# EAGLE design texboard (EAGLE 9.1.2)
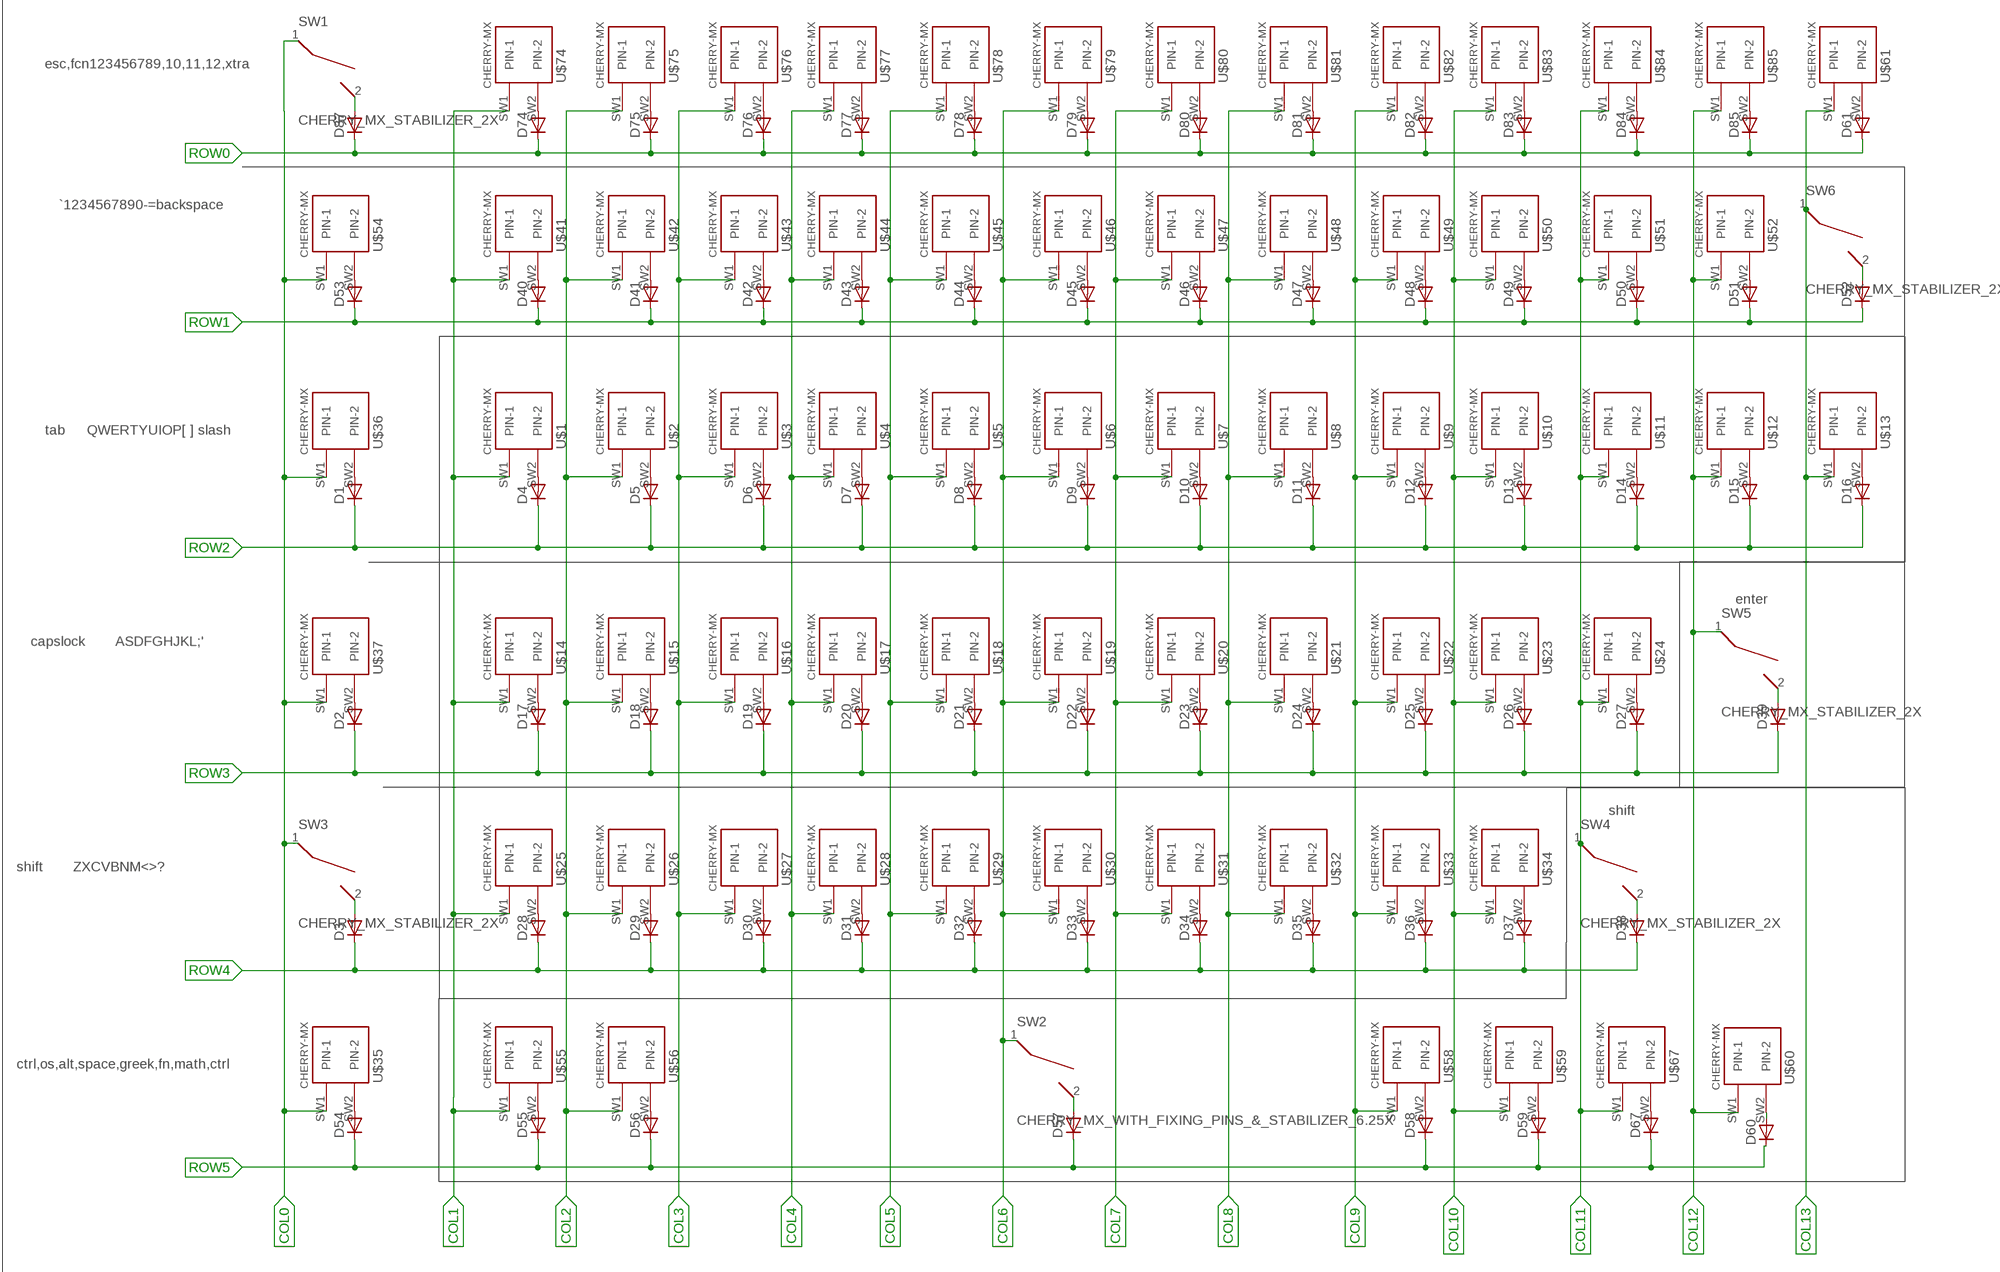
[diagram p0: schematic, sheet 1, part 1 of 2]
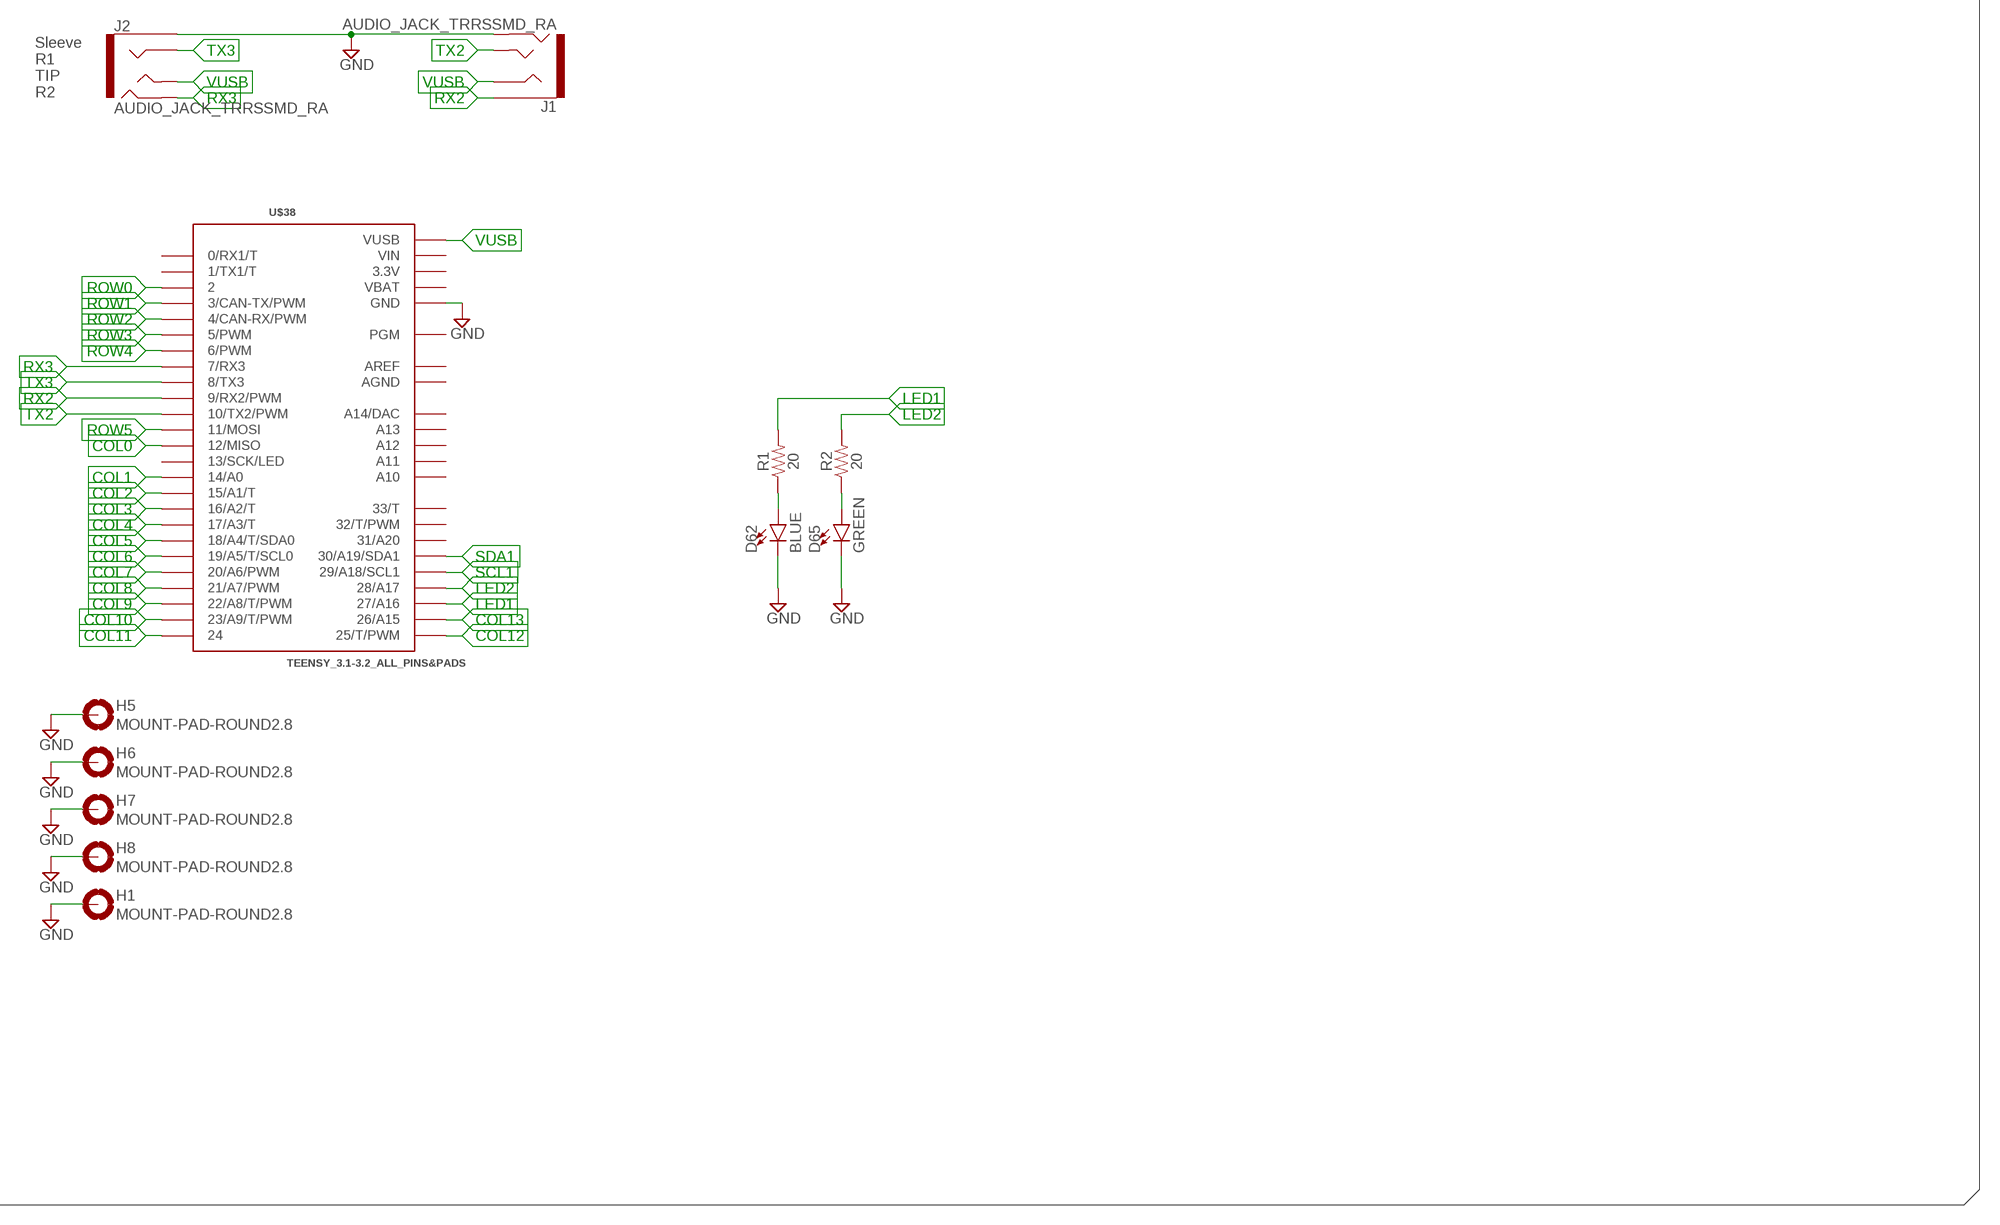
[diagram p1: schematic, sheet 1, part 2 of 2]

## Parts
D1  DIODE_E-DO35-7  [DIODE_DO35-7]
D2  DIODE_E-DO35-7  [DIODE_DO35-7]
D3  DIODE_E-DO35-7  [DIODE_DO35-7]
D4  DIODE_E-DO35-7  [DIODE_DO35-7]
D5  DIODE_E-DO35-7  [DIODE_DO35-7]
D6  DIODE_E-DO35-7  [DIODE_DO35-7]
D7  DIODE_E-DO35-7  [DIODE_DO35-7]
D8  DIODE_E-DO35-7  [DIODE_DO35-7]
D9  DIODE_E-DO35-7  [DIODE_DO35-7]
D10  DIODE_E-DO35-7  [DIODE_DO35-7]
D11  DIODE_E-DO35-7  [DIODE_DO35-7]
D12  DIODE_E-DO35-7  [DIODE_DO35-7]
D13  DIODE_E-DO35-7  [DIODE_DO35-7]
D14  DIODE_E-DO35-7  [DIODE_DO35-7]
D15  DIODE_E-DO35-7  [DIODE_DO35-7]
D16  DIODE_E-DO35-7  [DIODE_DO35-7]
D17  DIODE_E-DO35-7  [DIODE_DO35-7]
D18  DIODE_E-DO35-7  [DIODE_DO35-7]
D19  DIODE_E-DO35-7  [DIODE_DO35-7]
D20  DIODE_E-DO35-7  [DIODE_DO35-7]
D21  DIODE_E-DO35-7  [DIODE_DO35-7]
D22  DIODE_E-DO35-7  [DIODE_DO35-7]
D23  DIODE_E-DO35-7  [DIODE_DO35-7]
D24  DIODE_E-DO35-7  [DIODE_DO35-7]
D25  DIODE_E-DO35-7  [DIODE_DO35-7]
D26  DIODE_E-DO35-7  [DIODE_DO35-7]
D27  DIODE_E-DO35-7  [DIODE_DO35-7]
D28  DIODE_E-DO35-7  [DIODE_DO35-7]
D29  DIODE_E-DO35-7  [DIODE_DO35-7]
D30  DIODE_E-DO35-7  [DIODE_DO35-7]
D31  DIODE_E-DO35-7  [DIODE_DO35-7]
D32  DIODE_E-DO35-7  [DIODE_DO35-7]
D33  DIODE_E-DO35-7  [DIODE_DO35-7]
D34  DIODE_E-DO35-7  [DIODE_DO35-7]
D35  DIODE_E-DO35-7  [DIODE_DO35-7]
D36  DIODE_E-DO35-7  [DIODE_DO35-7]
D37  DIODE_E-DO35-7  [DIODE_DO35-7]
D38  DIODE_E-DO35-7  [DIODE_DO35-7]
D39  DIODE_E-DO35-7  [DIODE_DO35-7]
D40  DIODE_E-DO35-7  [DIODE_DO35-7]
D41  DIODE_E-DO35-7  [DIODE_DO35-7]
D42  DIODE_E-DO35-7  [DIODE_DO35-7]
D43  DIODE_E-DO35-7  [DIODE_DO35-7]
D44  DIODE_E-DO35-7  [DIODE_DO35-7]
D45  DIODE_E-DO35-7  [DIODE_DO35-7]
D46  DIODE_E-DO35-7  [DIODE_DO35-7]
D47  DIODE_E-DO35-7  [DIODE_DO35-7]
D48  DIODE_E-DO35-7  [DIODE_DO35-7]
D49  DIODE_E-DO35-7  [DIODE_DO35-7]
D50  DIODE_E-DO35-7  [DIODE_DO35-7]
D51  DIODE_E-DO35-7  [DIODE_DO35-7]
D52  DIODE_E-DO35-7  [DIODE_DO35-7]
D53  DIODE_E-DO35-7  [DIODE_DO35-7]
D54  DIODE_E-DO35-7  [DIODE_DO35-7]
D55  DIODE_E-DO35-7  [DIODE_DO35-7]
D56  DIODE_E-DO35-7  [DIODE_DO35-7]
D57  DIODE_E-DO35-7  [DIODE_DO35-7]
D58  DIODE_E-DO35-7  [DIODE_DO35-7]
D59  DIODE_E-DO35-7  [DIODE_DO35-7]
D60  DIODE_E-DO35-7  [DIODE_DO35-7]
D61  DIODE_E-DO35-7  [DIODE_DO35-7]
D62  BLUE  LED-BLUE0603  [LED-0603]
D65  GREEN  LED-GREEN0603  [LED-0603]
D67  DIODE_E-DO35-7  [DIODE_DO35-7]
D74  DIODE_E-DO35-7  [DIODE_DO35-7]
D75  DIODE_E-DO35-7  [DIODE_DO35-7]
D76  DIODE_E-DO35-7  [DIODE_DO35-7]
D77  DIODE_E-DO35-7  [DIODE_DO35-7]
D78  DIODE_E-DO35-7  [DIODE_DO35-7]
D79  DIODE_E-DO35-7  [DIODE_DO35-7]
D80  DIODE_E-DO35-7  [DIODE_DO35-7]
D81  DIODE_E-DO35-7  [DIODE_DO35-7]
D82  DIODE_E-DO35-7  [DIODE_DO35-7]
D83  DIODE_E-DO35-7  [DIODE_DO35-7]
D84  DIODE_E-DO35-7  [DIODE_DO35-7]
D85  DIODE_E-DO35-7  [DIODE_DO35-7]
D87  DIODE_E-DO35-7  [DIODE_DO35-7]
H1  MOUNT-PAD-ROUND2.8  [2,8-PAD]
H5  MOUNT-PAD-ROUND2.8  [2,8-PAD]
H6  MOUNT-PAD-ROUND2.8  [2,8-PAD]
H7  MOUNT-PAD-ROUND2.8  [2,8-PAD]
H8  MOUNT-PAD-ROUND2.8  [2,8-PAD]
J1  AUDIO_JACK_TRRSSMD_RA  [AUDIO_JACK_3.5MM_TRRS_SMD_RA]
J2  AUDIO_JACK_TRRSSMD_RA  [AUDIO_JACK_3.5MM_TRRS_SMD_RA]
R1  20  20OHM-0603-1/10W-1%  [0603]
R2  20  20OHM-0603-1/10W-1%  [0603]
SW1  CHERRY_MX_STABILIZER_2X  [MX1A-XXNN_WITH_STABILIZER_2X]
SW2  CHERRY_MX_WITH_FIXING_PINS_&_STABILIZER_6.25X  [MX1A-XXNW_WITH_STABILIZER_6.25X]
SW3  CHERRY_MX_STABILIZER_2X  [MX1A-XXNN_WITH_STABILIZER_2X]
SW4  CHERRY_MX_STABILIZER_2X  [MX1A-XXNN_WITH_STABILIZER_2X]
SW5  CHERRY_MX_STABILIZER_2X  [MX1A-XXNN_WITH_STABILIZER_2X]
SW6  CHERRY_MX_STABILIZER_2X  [MX1A-XXNN_WITH_STABILIZER_2X]
U$1  CHERRY-MX  [CHERRY-MX]
U$2  CHERRY-MX  [CHERRY-MX]
U$3  CHERRY-MX  [CHERRY-MX]
U$4  CHERRY-MX  [CHERRY-MX]
U$5  CHERRY-MX  [CHERRY-MX]
U$6  CHERRY-MX  [CHERRY-MX]
U$7  CHERRY-MX  [CHERRY-MX]
U$8  CHERRY-MX  [CHERRY-MX]
U$9  CHERRY-MX  [CHERRY-MX]
U$10  CHERRY-MX  [CHERRY-MX]
U$11  CHERRY-MX  [CHERRY-MX]
U$12  CHERRY-MX  [CHERRY-MX]
U$13  CHERRY-MX  [CHERRY-MX]
U$14  CHERRY-MX  [CHERRY-MX]
U$15  CHERRY-MX  [CHERRY-MX]
U$16  CHERRY-MX  [CHERRY-MX]
U$17  CHERRY-MX  [CHERRY-MX]
U$18  CHERRY-MX  [CHERRY-MX]
U$19  CHERRY-MX  [CHERRY-MX]
U$20  CHERRY-MX  [CHERRY-MX]
U$21  CHERRY-MX  [CHERRY-MX]
U$22  CHERRY-MX  [CHERRY-MX]
U$23  CHERRY-MX  [CHERRY-MX]
U$24  CHERRY-MX  [CHERRY-MX]
U$25  CHERRY-MX  [CHERRY-MX]
U$26  CHERRY-MX  [CHERRY-MX]
U$27  CHERRY-MX  [CHERRY-MX]
U$28  CHERRY-MX  [CHERRY-MX]
U$29  CHERRY-MX  [CHERRY-MX]
U$30  CHERRY-MX  [CHERRY-MX]
U$31  CHERRY-MX  [CHERRY-MX]
U$32  CHERRY-MX  [CHERRY-MX]
U$33  CHERRY-MX  [CHERRY-MX]
U$34  CHERRY-MX  [CHERRY-MX]
U$35  CHERRY-MX  [CHERRY-MX]
U$36  CHERRY-MX  [CHERRY-MX]
U$37  CHERRY-MX  [CHERRY-MX]
U$38  TEENSY_3.1-3.2_ALL_PINS&PADS  [TEENSY_3.0-3.2_ALL_PINS_&_PADS]
U$41  CHERRY-MX  [CHERRY-MX]
U$42  CHERRY-MX  [CHERRY-MX]
U$43  CHERRY-MX  [CHERRY-MX]
U$44  CHERRY-MX  [CHERRY-MX]
U$45  CHERRY-MX  [CHERRY-MX]
U$46  CHERRY-MX  [CHERRY-MX]
U$47  CHERRY-MX  [CHERRY-MX]
U$48  CHERRY-MX  [CHERRY-MX]
U$49  CHERRY-MX  [CHERRY-MX]
U$50  CHERRY-MX  [CHERRY-MX]
U$51  CHERRY-MX  [CHERRY-MX]
U$52  CHERRY-MX  [CHERRY-MX]
U$54  CHERRY-MX  [CHERRY-MX]
U$55  CHERRY-MX  [CHERRY-MX]
U$56  CHERRY-MX  [CHERRY-MX]
U$58  CHERRY-MX  [CHERRY-MX]
U$59  CHERRY-MX  [CHERRY-MX]
U$60  CHERRY-MX  [CHERRY-MX]
U$61  CHERRY-MX  [CHERRY-MX]
U$67  CHERRY-MX  [CHERRY-MX]
U$74  CHERRY-MX  [CHERRY-MX]
U$75  CHERRY-MX  [CHERRY-MX]
U$76  CHERRY-MX  [CHERRY-MX]
U$77  CHERRY-MX  [CHERRY-MX]
U$78  CHERRY-MX  [CHERRY-MX]
U$79  CHERRY-MX  [CHERRY-MX]
U$80  CHERRY-MX  [CHERRY-MX]
U$81  CHERRY-MX  [CHERRY-MX]
U$82  CHERRY-MX  [CHERRY-MX]
U$83  CHERRY-MX  [CHERRY-MX]
U$84  CHERRY-MX  [CHERRY-MX]
U$85  CHERRY-MX  [CHERRY-MX]

## Nets
COL0: SW1.1 SW3.1 U$35.SW1(PIN-1) U$36.SW1(PIN-1) U$37.SW1(PIN-1) U$38.12(12/MISO) U$54.SW1(PIN-1)
COL1: U$1.SW1(PIN-1) U$14.SW1(PIN-1) U$25.SW1(PIN-1) U$38.14/A0 U$41.SW1(PIN-1) U$55.SW1(PIN-1) U$74.SW1(PIN-1)
COL2: U$2.SW1(PIN-1) U$15.SW1(PIN-1) U$26.SW1(PIN-1) U$38.15/A1(15/A1/T) U$42.SW1(PIN-1) U$56.SW1(PIN-1) U$75.SW1(PIN-1)
COL3: U$3.SW1(PIN-1) U$16.SW1(PIN-1) U$27.SW1(PIN-1) U$38.16/A2(16/A2/T) U$43.SW1(PIN-1) U$76.SW1(PIN-1)
COL4: U$4.SW1(PIN-1) U$17.SW1(PIN-1) U$28.SW1(PIN-1) U$38.17/A3(17/A3/T) U$44.SW1(PIN-1) U$77.SW1(PIN-1)
COL5: U$5.SW1(PIN-1) U$18.SW1(PIN-1) U$29.SW1(PIN-1) U$38.18/A4(18/A4/T/SDA0) U$45.SW1(PIN-1) U$78.SW1(PIN-1)
COL6: SW2.1 U$6.SW1(PIN-1) U$19.SW1(PIN-1) U$30.SW1(PIN-1) U$38.19/A5(19/A5/T/SCL0) U$46.SW1(PIN-1) U$79.SW1(PIN-1)
COL7: U$7.SW1(PIN-1) U$20.SW1(PIN-1) U$31.SW1(PIN-1) U$38.20/A6(20/A6/PWM) U$47.SW1(PIN-1) U$80.SW1(PIN-1)
COL8: U$8.SW1(PIN-1) U$21.SW1(PIN-1) U$32.SW1(PIN-1) U$38.21/A7(21/A7/PWM) U$48.SW1(PIN-1) U$81.SW1(PIN-1)
COL9: U$9.SW1(PIN-1) U$22.SW1(PIN-1) U$33.SW1(PIN-1) U$38.22/A8(22/A8/T/PWM) U$49.SW1(PIN-1) U$58.SW1(PIN-1) U$82.SW1(PIN-1)
COL10: U$10.SW1(PIN-1) U$23.SW1(PIN-1) U$34.SW1(PIN-1) U$38.23/A9(23/A9/T/PWM) U$50.SW1(PIN-1) U$59.SW1(PIN-1) U$83.SW1(PIN-1)
COL11: SW4.1 U$11.SW1(PIN-1) U$24.SW1(PIN-1) U$38.24 U$51.SW1(PIN-1) U$67.SW1(PIN-1) U$84.SW1(PIN-1)
COL12: SW5.1 U$12.SW1(PIN-1) U$38.25(25/T/PWM) U$52.SW1(PIN-1) U$60.SW1(PIN-1) U$85.SW1(PIN-1)
COL13: SW6.1 U$13.SW1(PIN-1) U$38.26(26/A15) U$61.SW1(PIN-1)
GND: D62.C D65.C H1.B2,8(MOUNT) H5.B2,8(MOUNT) H6.B2,8(MOUNT) H7.B2,8(MOUNT) H8.B2,8(MOUNT) J1.RING2 J2.EARTH U$38.GND U$38.GND1(GND) U$38.GND2(GND)
LED1: R1.2 U$38.27(27/A16)
LED2: R2.2 U$38.28(28/A17)
N$1: D4.A(C) U$1.SW2(PIN-2)
N$2: D5.A(C) U$2.SW2(PIN-2)
N$3: D6.A(C) U$3.SW2(PIN-2)
N$4: D7.A(C) U$4.SW2(PIN-2)
N$5: D8.A(C) U$5.SW2(PIN-2)
N$6: D9.A(C) U$6.SW2(PIN-2)
N$7: D10.A(C) U$7.SW2(PIN-2)
N$8: D11.A(C) U$8.SW2(PIN-2)
N$9: D12.A(C) U$9.SW2(PIN-2)
N$10: D13.A(C) U$10.SW2(PIN-2)
N$11: D14.A(C) U$11.SW2(PIN-2)
N$12: D15.A(C) U$12.SW2(PIN-2)
N$13: D16.A(C) U$13.SW2(PIN-2)
N$14: D17.A(C) U$14.SW2(PIN-2)
N$15: D18.A(C) U$15.SW2(PIN-2)
N$16: D19.A(C) U$16.SW2(PIN-2)
N$17: D20.A(C) U$17.SW2(PIN-2)
N$18: D21.A(C) U$18.SW2(PIN-2)
N$19: D22.A(C) U$19.SW2(PIN-2)
N$20: D23.A(C) U$20.SW2(PIN-2)
N$21: D24.A(C) U$21.SW2(PIN-2)
N$22: D25.A(C) U$22.SW2(PIN-2)
N$23: D26.A(C) U$23.SW2(PIN-2)
N$24: D27.A(C) U$24.SW2(PIN-2)
N$25: D28.A(C) U$25.SW2(PIN-2)
N$26: D29.A(C) U$26.SW2(PIN-2)
N$27: D30.A(C) U$27.SW2(PIN-2)
N$28: D31.A(C) U$28.SW2(PIN-2)
N$29: D32.A(C) U$29.SW2(PIN-2)
N$30: D33.A(C) U$30.SW2(PIN-2)
N$31: D34.A(C) U$31.SW2(PIN-2)
N$32: D35.A(C) U$32.SW2(PIN-2)
N$33: D36.A(C) U$33.SW2(PIN-2)
N$34: D37.A(C) U$34.SW2(PIN-2)
N$35: D60.A(C) U$60.SW2(PIN-2)
N$36: D61.A(C) U$61.SW2(PIN-2)
N$37: D62.A R1.1
N$38: D65.A R2.1
N$41: D67.A(C) U$67.SW2(PIN-2)
N$43: D57.A(C) SW2.2
N$44: D87.A(C) SW1.2
N$51: D1.A(C) U$36.SW2(PIN-2)
N$52: D2.A(C) U$37.SW2(PIN-2)
N$53: D3.A(C) SW3.2
N$54: D38.A(C) SW4.2
N$55: D39.A(C) SW5.2
N$56: D40.A(C) U$41.SW2(PIN-2)
N$57: D41.A(C) U$42.SW2(PIN-2)
N$58: D42.A(C) U$43.SW2(PIN-2)
N$59: D43.A(C) U$44.SW2(PIN-2)
N$60: D44.A(C) U$45.SW2(PIN-2)
N$61: D45.A(C) U$46.SW2(PIN-2)
N$62: D46.A(C) U$47.SW2(PIN-2)
N$63: D47.A(C) U$48.SW2(PIN-2)
N$64: D48.A(C) U$49.SW2(PIN-2)
N$65: D49.A(C) U$50.SW2(PIN-2)
N$66: D50.A(C) U$51.SW2(PIN-2)
N$67: D51.A(C) U$52.SW2(PIN-2)
N$68: D52.A(C) SW6.2
N$70: D54.A(C) U$35.SW2(PIN-2)
N$71: D55.A(C) U$55.SW2(PIN-2)
N$72: D56.A(C) U$56.SW2(PIN-2)
N$74: D58.A(C) U$58.SW2(PIN-2)
N$75: D59.A(C) U$59.SW2(PIN-2)
N$83: D53.A(C) U$54.SW2(PIN-2)
N$119: D74.A(C) U$74.SW2(PIN-2)
N$120: D75.A(C) U$75.SW2(PIN-2)
N$121: D76.A(C) U$76.SW2(PIN-2)
N$122: D77.A(C) U$77.SW2(PIN-2)
N$123: D78.A(C) U$78.SW2(PIN-2)
N$124: D79.A(C) U$79.SW2(PIN-2)
N$125: D80.A(C) U$80.SW2(PIN-2)
N$126: D81.A(C) U$81.SW2(PIN-2)
N$127: D82.A(C) U$82.SW2(PIN-2)
N$128: D83.A(C) U$83.SW2(PIN-2)
N$129: D84.A(C) U$84.SW2(PIN-2)
N$130: D85.A(C) U$85.SW2(PIN-2)
ROW0: D61.C(A) D74.C(A) D75.C(A) D76.C(A) D77.C(A) D78.C(A) D79.C(A) D80.C(A) D81.C(A) D82.C(A) D83.C(A) D84.C(A) D85.C(A) D87.C(A) U$38.2
ROW1: D40.C(A) D41.C(A) D42.C(A) D43.C(A) D44.C(A) D45.C(A) D46.C(A) D47.C(A) D48.C(A) D49.C(A) D50.C(A) D51.C(A) D52.C(A) D53.C(A) U$38.3(3/CAN-TX/PWM)
ROW2: D1.C(A) D4.C(A) D5.C(A) D6.C(A) D7.C(A) D8.C(A) D9.C(A) D10.C(A) D11.C(A) D12.C(A) D13.C(A) D14.C(A) D15.C(A) D16.C(A) U$38.4(4/CAN-RX/PWM)
ROW3: D2.C(A) D17.C(A) D18.C(A) D19.C(A) D20.C(A) D21.C(A) D22.C(A) D23.C(A) D24.C(A) D25.C(A) D26.C(A) D27.C(A) D39.C(A) U$38.5(5/PWM)
ROW4: D3.C(A) D28.C(A) D29.C(A) D30.C(A) D31.C(A) D32.C(A) D33.C(A) D34.C(A) D35.C(A) D36.C(A) D37.C(A) D38.C(A) U$38.6(6/PWM)
ROW5: D54.C(A) D55.C(A) D56.C(A) D57.C(A) D58.C(A) D59.C(A) D60.C(A) D67.C(A) U$38.11(11/MOSI)
RX2: J1.EARTH U$38.9(9/RX2/PWM)
RX3: J2.RING2 U$38.7(7/RX3)
SCL1: U$38.29(29/A18/SCL1)
SDA1: U$38.30(30/A19/SDA1)
TX2: J1.TIP U$38.10(10/TX2/PWM)
TX3: J2.RING1 U$38.8(8/TX3)
VUSB: J1.RING1 J2.TIP U$38.VUSB
Unconnected: U$38.0(0/RX1/T) U$38.1(1/TX1/T) U$38.13(13/SCK/LED) U$38.31(31/A20) U$38.32(32/T/PWM) U$38.33(33/T) U$38.A10 U$38.A11 U$38.A12 U$38.A13 U$38.PGM U$38.RESET/DAC(A14/DAC)

## Notes on the sheet
- esc,fcn123456789,10,11,12,xtra
- `1234567890-=backspace
- Sleeve
  R1
  TIP
  R2
- tab | QWERTYUIOP[ ] slash
- enter
- capslock | ASDFGHJKL;'
- shift
- shift | ZXCVBNM<>?
- ctrl,os,alt,space,greek,fn,math,ctrl

## Power pins joined to a net without a drawn wire
3.3V: U$38.3.3V U$38.3.3V1(3.3V) U$38.3.3V2(3.3V)
AGND: U$38.AGND
AREF: U$38.AREF
VBAT: U$38.VBAT
VIN: U$38.VIN

## Library data of the parts
D1-D61 D67 D74-D85 D87 = eagle-ltspice:DIODE_E-: Schottky Diode; SPICEMODEL: diode; SPICEPREFIX: D
D62 = SparkFun-LED:LED-BLUE: Blue SMD LED Used in manufacturing of various products at SparkFun Packages: 0603 - SMD 0603 package [Product Link] <http://www.digikey.com/product-detail/en/SMLE12BC7TT86/511-1589-2-ND/1641808> 1206 - SMD1206 package [Product Link] <http://www.digikey.com/product-detail/en/lite-on-inc/LTST-C150TBKT/160-1643-1-ND/573584> SparkFun Products: ESP8266 Thing-Dev Board <https://www.sparkfun.com/products/13711> RedBoard <https://www.sparkfun.com/products/12757>; PROD_ID: DIO-08575
D65 = SparkFun-LED:LED-GREEN: Green SMD LED Used in manufacturing of various products at SparkFun Packages: 0603 - SMD 0603 package [Product Link] <http://www.futureelectronics.com/en/technologies/semiconductors/optoelectronics/leds/Pages/9894312-LTST-C190GKT.aspx?CrossPart=HSMG-C190&IM=0> LilyPad 1206 - SMD1206 LilyPad package [Product Link] <http://www.futureelectronics.com/en/Technologies/Product.aspx?ProductID=IN150NGHARVATEKCORPORATION2049943&IM=0> 1206 - SMD1206 package [Product Link] <http://www.futureelectronics.com/en/technologies/semiconductors/optoelectronics/leds/Pages/8315665-LTST-C150KGKT.aspx?IM=0> 1206 Bottom Mount -SMD 1206 Bottom Mount [Product Link] <http://www.digikey.com/product-detail/en/lite-on-inc/LTST-C230KGKT/160-1456-1-ND/386854> SparkFun Products: Pro Mini 328 -5V <https://www.sparkfun.com/products/821> RedBoard <https://www.sparkfun.com/products/12757> MP3 Trigger <https://www.sparkfun.com/products/13720> Makey Makey <https://www.sparkfun.com/products/11076>; PROD_ID: DIO-00821
H1 H5-H8 = holes:MOUNT-PAD-ROUND: MOUNTING PAD, round
J1 J2 = SparkFun-Connectors:AUDIO_JACK_TRRS: Audio Jack - 3.5mm TRRS (SMD) This is a 3.5mm TRRS SMD audio jack. TRRS connectors are the audio-style connectors that you see on some phones, MP3 players and development boards. TRRS stands for “tip, ring, ring, sleeve,” which reflects that this has three conductors and a ground. SparkFun Products: Audio Jack <https://www.sparkfun.com/products/12639> mbed Starter Kit <https://www.sparkfun.com/products/12968> SparkFun TRRS 3.5mm Jack Breakout <https://www.sparkfun.com/products/11570>; PROD_ID: CONN-10676; SF_ID: PRT-12639
R1 R2 = SparkFun-Resistors:20OHM: RES-07862; PROD_ID: RES-07862
SW1-SW6 = Cherry_MX_v7.0:CHERRY_MX
U$1-U$37 U$41-U$52 U$54-U$56 U$58-U$61 U$67 U$74-U$85 = cherrymx:CHERRY-MX: Cherry MX series keyswitch
U$38 = Teensy_3_and_LC_Series_Boards_v1.4:TEENSY_3.1-3.2_ALL_PINS&PADS: Footprint for Teensy 3.1 or 3.2 board using all pads and all through-holes. Pads need a 2x7 0.1" SMD header.

## Board
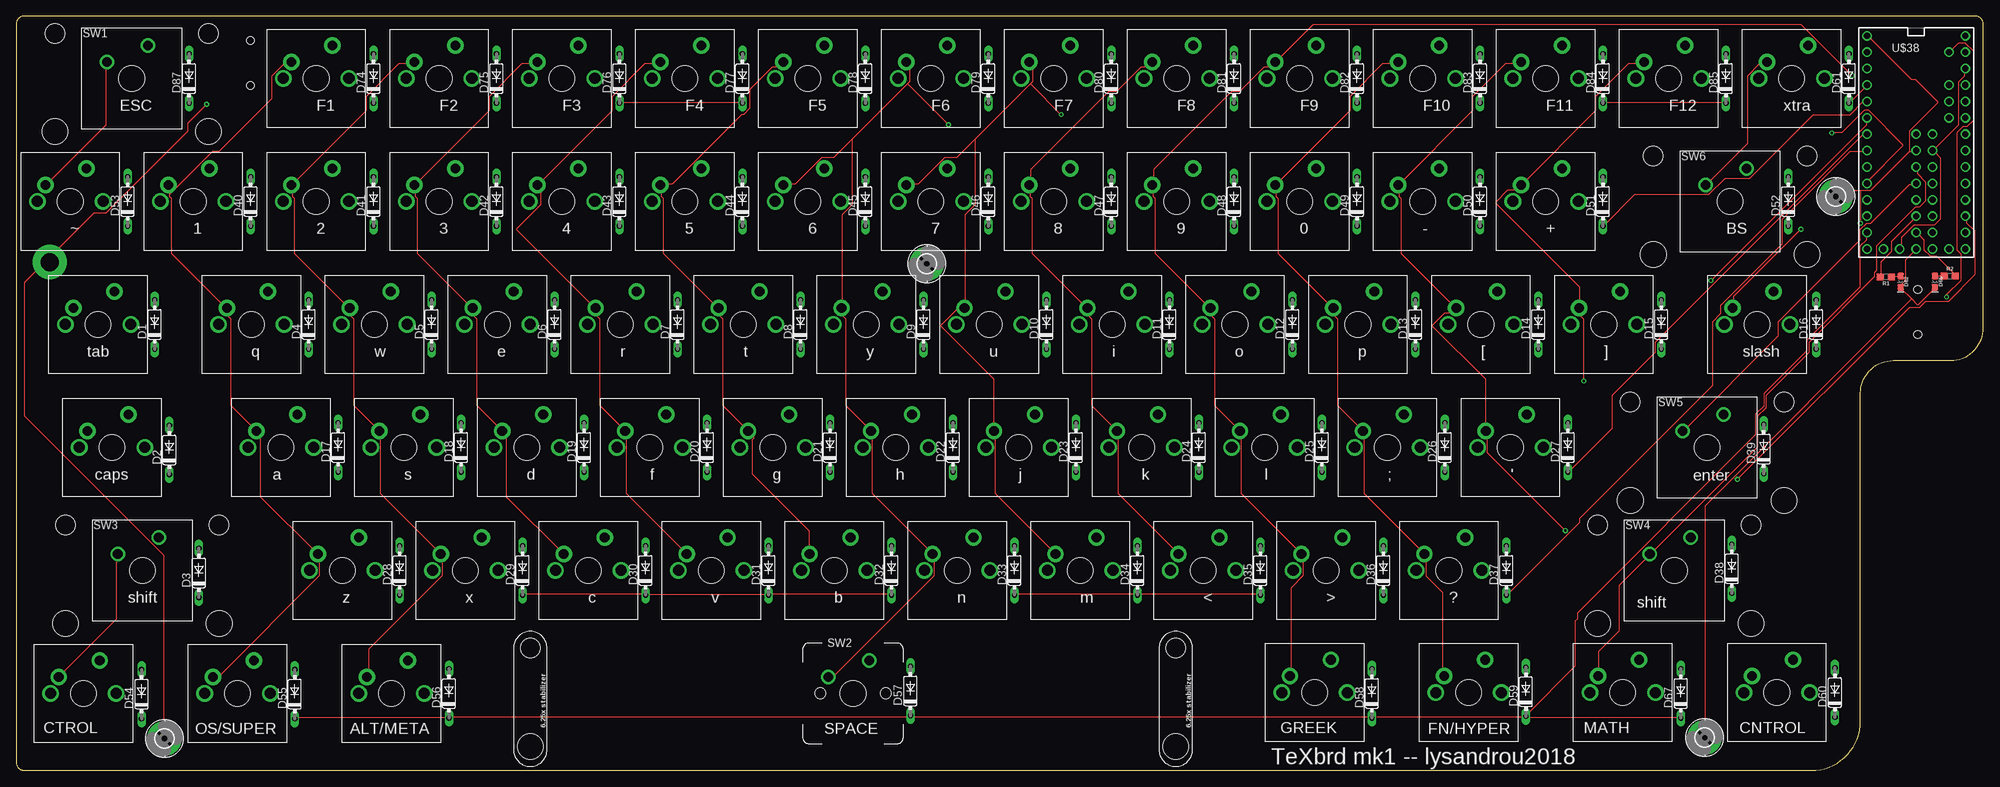
[diagram p2: board, top side]
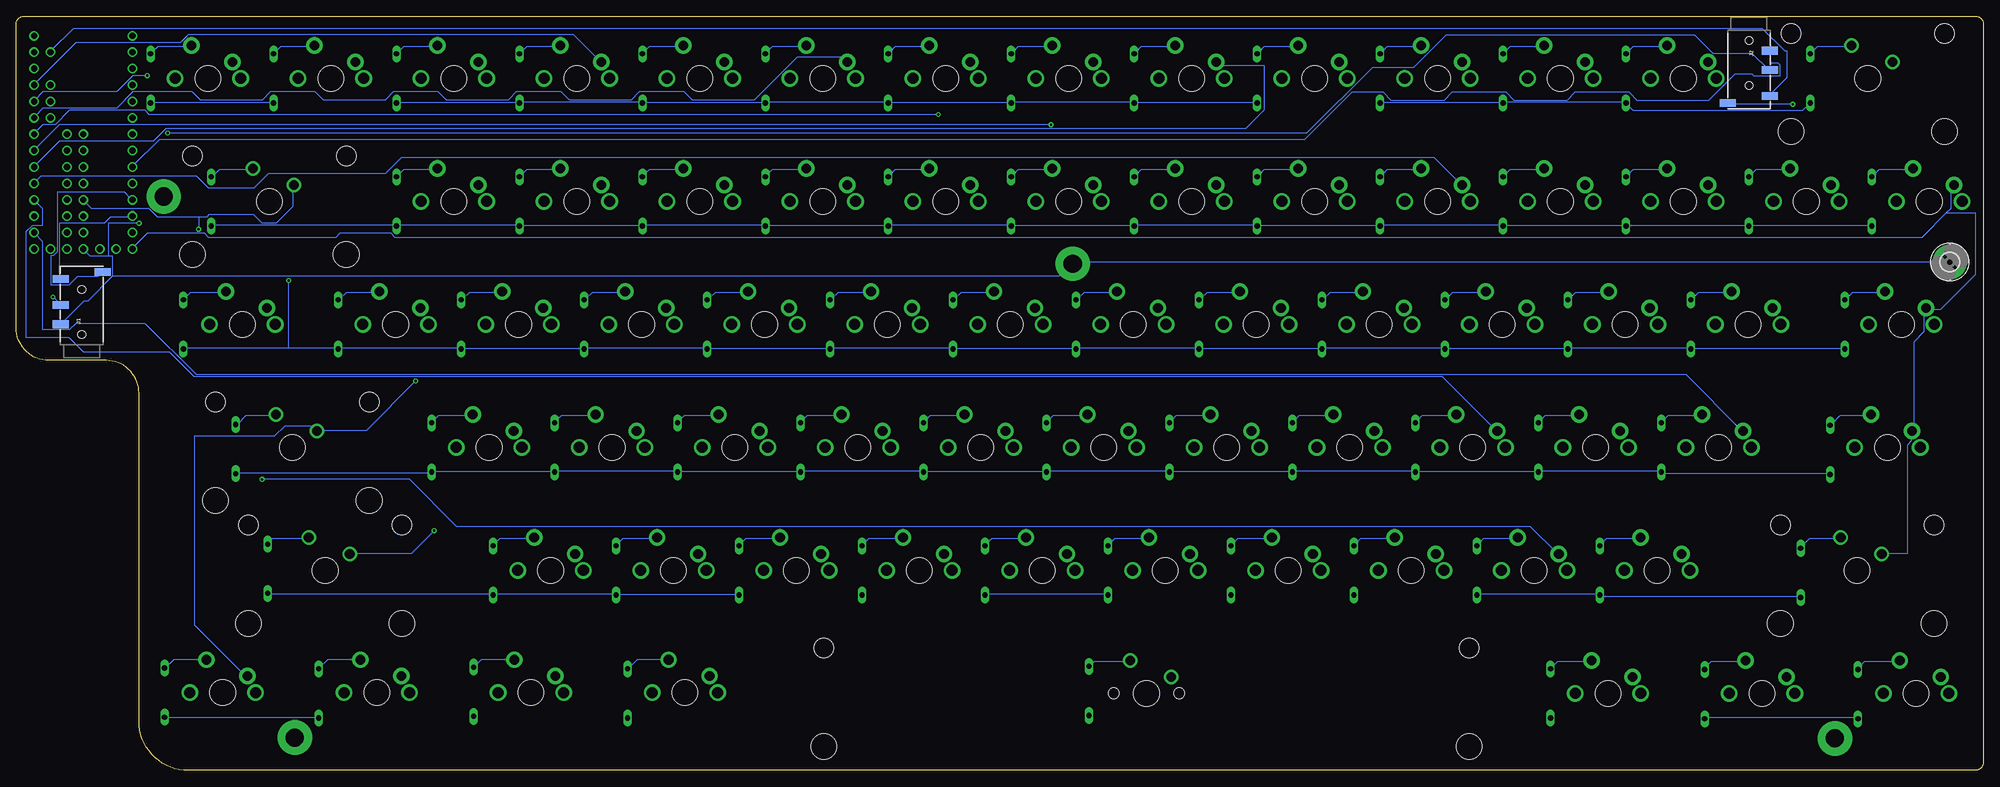
[diagram p3: board, bottom side, seen from below]

Size 304.8 x 116.84 mm. Coordinates in mm from the lower left corner, seen from the top.
Outline: 0,115.57 0,1.3 arc90 1.3,0 278.13,0 arc90 285.75,7.62 285.75,39.37 285.75,58.42 arc-90 290.83,63.5 299.72,63.5 arc90 304.8,68.58 304.8,115.57 arc90 303.53,116.84 1.27,116.84 arc90 0,115.57
Copper layers (1*16): Top 0.035mm / dielectric 1.5mm / Bottom 0.035mm
Design rules "default": minimum track width 6mil, minimum drill 0.35mm, track to track 6mil, track to pad 6mil, pad to pad 6mil, via to via 6mil, smd to smd 6mil, copper to edge 40mil, drill to drill 6mil, minimum pad ring 10mil, minimum via ring 8mil, stop-mask expansion 4mil, vias tented up to drill 0mil, thermal gap 10mil

### Footprints (pad centres in the part's own frame; a part is rotated, then mirrored left to right if it is on the bottom)
DIODE_DO35-7 = drill 0.813 long: A 3.81,0; C -3.81,0
LED-0603 = smd 1 x 1: A -0.877,0; C 0.877,0
2,8-PAD = drill 2.8 pad 5.334: B2,8 0,0
AUDIO_JACK_3.5MM_TRRS_SMD_RA = smd 1.2 x 2.5: EARTH 11.3,-3.25; RING1 6.2,3.25; RING2 3.2,3.25; TIP 10.2,3.25 | hole 1.2: 1.6,0; 8.6,0
0603 = smd 1.1 x 1: 1 -0.85,0; 2 0.85,0
MX1A-XXNN_WITH_STABILIZER_2X = drill 1.5: 1 -3.81,2.54; 2 2.54,5.08 | hole 4: 0,0; 11.9,-8.24; -11.9,-8.24 | hole 3.05: -11.9,7; 11.9,7
MX1A-XXNW_WITH_STABILIZER_6.25X = drill 1.5: 1 -3.81,2.54; 2 2.54,5.08 | hole 4: 0,0; 50,-8.24; -50,-8.24 | hole 1.7: -5.08,0; 5.08,0 | hole 3.05: -50,7; 50,7
CHERRY-MX = drill 1.714 pad 1.93: P$3 -5.08,0; P$4 5.08,0 | drill 1.5 pad 2.54: SW1 -3.81,2.54; SW2 2.54,5.08 | hole 4: 0,0
TEENSY_3.0-3.2_ALL_PINS_&_PADS = drill 0.965: 0 -7.62,13.97; 1 -7.62,11.43; 2 -7.62,8.89; 3 -7.62,6.35; 3.3V 7.62,11.43; 3.3V1 -2.54,-16.51; 3.3V2 2.54,-1.27; 4 -7.62,3.81; 5 -7.62,1.27; 6 -7.62,-1.27; 7 -7.62,-3.81; 8 -7.62,-6.35; 9 -7.62,-8.89; 10 -7.62,-11.43; 11 -7.62,-13.97; 12 -7.62,-16.51; 13 7.62,-16.51; 14/A0 7.62,-13.97; 15/A1 7.62,-11.43; 16/A2 7.62,-8.89; 17/A3 7.62,-6.35; 18/A4 7.62,-3.81; 19/A5 7.62,-1.27; 20/A6 7.62,1.27; 21/A7 7.62,3.81; 22/A8 7.62,6.35; 23/A9 7.62,8.89; 24 0,-3.81; 25 0,-6.35; 26 0,-8.89; 27 0,-11.43; 28 0,-13.97; 29 2.54,-13.97; 30 2.54,-11.43; 31 2.54,-8.89; 32 2.54,-6.35; 33 2.54,-3.81; A10 5.08,6.35; A11 5.08,3.81; A12 0,1.27; A13 2.54,1.27; AGND 7.62,13.97; AREF 5.08,8.89; GND -7.62,16.51; GND1 0,-16.51; GND2 0,-1.27; PGM 2.54,-16.51; RESET/DAC 5.08,-16.51; VBAT -5.08,-16.51; VIN 7.62,16.51; VUSB 5.08,13.97

### Placement (x,y rotation side)
D1  21.46,69.09 90 top
D2  23.75,49.66 90 top
D3  28.32,30.61 90 top
D4  45.34,69.09 90 top
D5  64.39,69.09 90 top
D6  83.44,69.09 90 top
D7  102.49,69.09 90 top
D8  121.54,69.09 90 top
D9  140.59,69.09 90 top
D10  159.64,69.09 90 top
D11  178.69,69.09 90 top
D12  197.74,69.09 90 top
D13  216.79,69.09 90 top
D14  235.84,69.09 90 top
D15  254.89,69.09 90 top
D16  278.89,69.09 90 top
D17  49.91,50.04 90 top
D18  68.96,50.04 90 top
D19  88.01,50.04 90 top
D20  107.06,50.04 90 top
D21  126.11,50.04 90 top
D22  145.16,50.04 90 top
D23  164.21,50.04 90 top
D24  183.26,50.04 90 top
D25  202.31,50.04 90 top
D26  221.36,50.04 90 top
D27  240.41,50.04 90 top
D28  59.44,30.99 90 top
D29  78.49,30.99 90 top
D30  97.54,30.99 90 top
D31  116.59,30.99 90 top
D32  135.64,30.99 90 top
D33  154.69,30.99 90 top
D34  173.74,30.99 90 top
D35  192.79,30.99 90 top
D36  211.84,30.99 90 top
D37  230.89,30.99 90 top
D38  265.81,31.24 90 top
D39  270.76,49.78 90 top
D40  36.32,88.14 90 top
D41  55.37,88.14 90 top
D42  74.42,88.14 90 top
D43  93.47,88.14 90 top
D44  112.52,88.14 90 top
D45  131.57,88.14 90 top
D46  150.62,88.14 90 top
D47  169.67,88.14 90 top
D48  188.72,88.14 90 top
D49  207.77,88.14 90 top
D50  226.82,88.14 90 top
D51  245.87,88.14 90 top
D52  274.57,88.14 90 top
D53  17.27,88.14 90 top
D54  19.43,11.81 90 top
D55  43.18,11.81 90 top
D56  67.06,11.94 90 top
D57  138.56,12.32 90 top
D58  210.06,11.94 90 top
D59  233.93,12.19 90 top
D60  281.81,12.06 90 top
D61  283.97,107.19 90 top
D62  291.97,75.69 270 top
D65  297.31,75.69 270 top
D67  257.94,11.94 90 top
D74  55.37,107.19 90 top
D75  74.42,107.19 90 top
D76  93.47,107.19 90 top
D77  112.52,107.19 90 top
D78  131.57,107.19 90 top
D79  150.62,107.19 90 top
D80  169.67,107.19 90 top
D81  188.72,107.19 90 top
D82  207.77,107.19 90 top
D83  226.82,107.19 90 top
D84  245.87,107.19 90 top
D85  264.92,107.19 90 top
D87  26.8,107.19 90 top
H1  281.94,88.9 0 top
H5  261.62,5.08 0 top
H6  22.99,4.95 0 top
H7  141.1,78.49 0 top
H8  5.21,78.74 0 bottom
J1  294.64,65.91 90 bottom
J2  36.32,114.68 270 bottom
R1  289.69,76.45 180 top
R2  299.59,76.58 0 top
SW1  17.91,107.19 0 top
SW2  129.67,11.94 0 top
SW3  19.56,30.99 0 top
SW4  256.92,30.99 0 top
SW5  262,50.04 0 top
SW6  265.56,88.14 0 top
U$1  36.45,69.09 0 top
U$2  55.5,69.09 0 top
U$3  74.55,69.09 0 top
U$4  93.6,69.09 0 top
U$5  112.65,69.09 0 top
U$6  131.7,69.09 0 top
U$7  150.75,69.09 0 top
U$8  169.8,69.09 0 top
U$9  188.85,69.09 0 top
U$10  207.9,69.09 0 top
U$11  226.95,69.09 0 top
U$12  246,69.09 0 top
U$13  269.75,69.09 0 top
U$14  41.02,50.04 0 top
U$15  60.07,50.04 0 top
U$16  79.12,50.04 0 top
U$17  98.17,50.04 0 top
U$18  117.22,50.04 0 top
U$19  136.27,50.04 0 top
U$20  155.32,50.04 0 top
U$21  174.37,50.04 0 top
U$22  193.42,50.04 0 top
U$23  212.47,50.04 0 top
U$24  231.52,50.04 0 top
U$25  50.55,30.99 0 top
U$26  69.6,30.99 0 top
U$27  88.65,30.99 0 top
U$28  107.7,30.99 0 top
U$29  126.75,30.99 0 top
U$30  145.8,30.99 0 top
U$31  164.85,30.99 0 top
U$32  183.9,30.99 0 top
U$33  202.95,30.99 0 top
U$34  222,30.99 0 top
U$35  10.41,11.94 0 top
U$36  12.7,69.09 0 top
U$37  14.86,50.04 0 top
U$38  294.39,97.28 0 top
U$41  27.43,88.14 0 top
U$42  46.48,88.14 0 top
U$43  65.53,88.14 0 top
U$44  84.58,88.14 0 top
U$45  103.63,88.14 0 top
U$46  122.68,88.14 0 top
U$47  141.73,88.14 0 top
U$48  160.78,88.14 0 top
U$49  179.83,88.14 0 top
U$50  198.88,88.14 0 top
U$51  217.93,88.14 0 top
U$52  236.98,88.14 0 top
U$54  8.38,88.14 0 top
U$55  34.29,11.94 0 top
U$56  58.17,11.94 0 top
U$58  201.17,12.06 0 top
U$59  225.04,12.06 0 top
U$60  272.8,12.06 0 top
U$61  275.08,107.19 0 top
U$67  248.92,12.06 0 top
U$74  46.48,107.19 0 top
U$75  65.53,107.19 0 top
U$76  84.58,107.19 0 top
U$77  103.63,107.19 0 top
U$78  122.68,107.19 0 top
U$79  141.73,107.19 0 top
U$80  160.78,107.19 0 top
U$81  179.83,107.19 0 top
U$82  198.88,107.19 0 top
U$83  217.93,107.19 0 top
U$84  236.98,107.19 0 top
U$85  256.03,107.19 0 top

### Tracks (layer width: path | path; a pad name or v marks a point on that pad's centre or on a via)
3.3V
  Top 0.152: U$38.3.3V1 292.1,80.96 292.1,82.55 294,84.45 297.18,84.45 298.13,85.41 298.13,94.93 297.18,95.89 U$38.3.3V2 297.18,96.2 300.99,100.01 300.99,106.68 301.94,107.63 301.94,108.58 U$38.3.3V
COL0
  Top 0.152: SW3.1 15.56,33.34 15.56,23.5 6.67,14.61 U$35.SW1 | SW1.1 13.97,109.54 13.97,100.01 4.76,90.81 U$54.SW1
  Bottom 0.152: SW3.1 15.56,33.66 11.75,33.66 11.75,50.48 11.11,51.12 11.11,52.39 U$37.SW1 10.79,52.7 10.79,66.36 9.21,67.94 9.21,71.44 8.89,71.44 U$36.SW1 8.64,71.37 6.67,71.37 1.27,76.77 1.27,86.36 2.54,86.36 5.71,86.36 | 5.71,86.36 5.08,87 5.08,90.49 4.76,90.49 U$54.SW1 | 5.71,86.36 9.53,82.55 246.06,82.55 246.7,83.19 254.63,83.19 255.27,82.55 274.95,82.55 275.59,83.19 284.48,83.19 286.7,80.96 U$38.12
COL1
  Top 0.152: U$55.SW1 30.48,14.61 31.43,14.61 46.99,30.16 46.99,33.34 U$25.SW1 37.93,42.34 37.93,51.92 37.15,52.7 | 37.15,52.7 36.51,53.34 | 36.51,53.34 33.34,56.52 33.34,69.85 32.7,70.48 32.7,71.44 U$1.SW1 32.38,71.75 24.13,80.01 24.13,88.58 23.81,88.9 23.81,89.22 | 37.15,52.7 U$14.SW1 36.51,53.34 | 23.81,89.22 23.81,90.49 U$41.SW1 | 23.81,89.22 30.48,95.89 31.43,95.89 39.69,104.14 39.69,107.63 41.59,109.54 42.55,109.54 U$74.SW1
  Bottom 0.152: U$38.14/A0 301.94,83.19 300.67,81.92 300.67,68.26 296.55,68.26 295.59,69.22 284.8,69.22 276.86,61.28 46.04,61.28 37.47,52.7 U$14.SW1
COL2  (via drill 0.35)
  Top 0.152: v266.7,45.09 293.37,71.75 294.96,71.75 295.91,72.71 299.4,72.71 303.53,76.83 303.53,83.5 302.26,84.77 302.26,85.72 U$38.15/A1 | U$56.SW1 54.61,14.61 54.61,18.73 66.04,30.16 66.04,33.34 U$26.SW1 65.72,33.66 56.52,42.86 56.52,52.39 U$15.SW1 56.2,52.7 52.39,56.52 52.39,69.85 51.75,70.48 51.75,71.44 U$2.SW1 51.44,71.75 43.18,80.01 43.18,88.58 42.86,88.9 42.86,90.49 U$42.SW1 42.86,90.81 54.29,102.23 54.29,104.46 59.37,109.54 61.59,109.54 U$75.SW1
  Bottom 0.152: v266.7,45.09 243.84,45.09 236.54,37.78 70.17,37.78 66.04,33.66 U$26.SW1
COL3
  Top 0.152: 75.25,52.7 71.44,56.52 71.44,69.85 70.8,70.48 70.8,71.44 U$3.SW1 70.48,71.75 62.23,80.01 62.23,88.58 61.91,88.9 61.91,90.49 U$43.SW1 61.91,90.81 73.34,102.23 73.34,104.46 78.42,109.54 80.64,109.54 U$76.SW1 | 75.25,52.7 U$16.SW1 | U$27.SW1 76.03,42.34 76.03,51.92 75.25,52.7
  Bottom 0.152: U$38.16/A2 301.94,88.27 300.67,87 300.67,84.45 302.26,84.45 303.21,83.5 303.21,66.99 296.55,66.99 294.32,64.77 280.99,64.77 277.18,60.96 83.82,60.96 75.56,52.7 U$16.SW1
COL4
  Top 0.152: U$28.SW1 103.82,33.66 94.61,42.86 94.61,52.39 U$17.SW1 94.3,52.7 90.49,56.52 90.49,69.85 89.85,70.48 89.85,71.44 U$4.SW1 89.53,71.75 77.47,83.82 81.28,87.63 81.28,91.12 | 81.28,91.12 80.96,90.81 U$44.SW1 81.28,91.12 | 81.28,91.12 92.39,102.23 92.39,104.46 97.47,109.54 99.69,109.54 U$77.SW1
  Bottom 0.152: U$38.17/A3 301.94,91.12 300.99,92.08 276.86,92.08 274.95,90.17 267.97,90.17 265.75,92.39 247.65,92.39 245.11,94.93 85.09,94.93 80.96,90.81 U$44.SW1
COL5
  Top 0.152: U$78.SW1 118.75,109.54 118.11,108.9 117.16,108.9 113.67,105.41 113.67,102.55 112.71,101.6 112.39,101.6 101.6,90.81 100.01,90.81 U$45.SW1 100.01,90.49 100.01,88.9 100.33,88.58 100.33,80.01 108.58,71.75 U$5.SW1 108.9,71.44 108.9,70.48 109.54,69.85 109.54,56.52 113.35,52.7 U$18.SW1 113.79,52.58 114.3,52.07 114.3,51.49 114.13,51.32 114.13,45.89 122.94,37.08 U$29.SW1
  Bottom 0.152: U$38.18/A4 301.94,93.66 298.13,97.47 283.53,97.47 281.62,99.38 114.3,99.38 111.44,102.23 111.44,109.22 118.43,109.22 118.75,109.54 U$78.SW1
COL6  (via drill 0.35)
  Top 0.152: SW2.1 126.05,14.61 126.68,14.61 142.24,30.16 142.24,33.34 U$30.SW1 141.92,33.66 132.72,42.86 132.72,52.39 U$19.SW1 132.4,52.7 128.59,56.52 128.59,69.85 127.95,70.48 127.95,71.44 U$6.SW1 127.95,71.75 127.95,86.04 129.54,87.63 129.54,97.79 | 138.11,106.36 v144.46,100.01 | 138.11,106.36 138.43,106.68 138.43,109.22 138.11,109.54 U$79.SW1 | 138.11,106.36 129.54,97.79 | 129.54,97.79 126.68,94.93 124.78,94.93 120.65,90.81 119.06,90.81 U$46.SW1
  Bottom 0.152: v144.46,100.01 298.13,100.01 301.94,96.2 U$38.19/A5
COL7  (via drill 0.35)
  Top 0.152: U$31.SW1 160.97,33.66 151.76,42.86 151.76,52.39 U$20.SW1 151.45,52.7 151.45,60.64 143.19,68.9 147,72.71 | 157.16,106.36 v161.93,101.6 | 157.16,106.36 157.48,106.68 157.48,109.22 157.16,109.54 U$80.SW1 | 157.16,106.36 148.59,97.79 | 148.59,97.79 145.73,94.93 143.83,94.93 139.7,90.81 138.11,90.81 U$47.SW1 | 147,72.71 147,86.04 148.59,87.63 148.59,97.79 | 147,72.71 147,71.75 U$7.SW1 147,72.71
  Bottom 0.152: v161.93,101.6 284.16,101.6 284.8,102.23 296.55,102.23 298.77,100.01 300.67,100.01 301.94,98.74 U$38.20/A6
COL8
  Top 0.152: U$32.SW1 180.02,33.66 170.81,42.86 170.81,52.39 U$21.SW1 170.5,52.7 166.69,56.52 166.69,69.85 166.05,70.48 166.05,71.44 U$8.SW1 165.74,71.75 157.48,80.01 157.48,88.58 157.16,88.9 157.16,90.49 U$48.SW1 157.16,90.81 157.16,93.03 169.23,105.09 170.5,105.09 174.31,108.9 175.26,108.9 175.9,109.54 U$81.SW1
  Bottom 0.152: U$38.21/A7 301.94,101.28 300.67,102.55 289.24,102.55 286.7,105.09 277.5,105.09 276.23,103.82 266.7,103.82 265.43,105.09 258.44,105.09 257.18,103.82 247.65,103.82 246.38,105.09 239.4,105.09 238.12,103.82 228.6,103.82 227.33,105.09 220.34,105.09 219.07,103.82 209.55,103.82 208.28,105.09 201.29,105.09 200.03,103.82 190.5,103.82 183.83,110.49 176.85,110.49 176.21,109.86 U$81.SW1
COL9  (via drill 0.35)
  Top 0.152: U$58.SW1 197.49,14.61 197.49,28.26 199.39,30.16 199.39,33.34 U$33.SW1 199.07,33.66 189.87,42.86 189.87,52.39 U$22.SW1 189.55,52.7 185.74,56.52 185.74,69.85 185.1,70.48 185.1,71.44 U$9.SW1 184.78,71.75 176.53,80.01 176.53,88.58 176.21,88.9 176.21,90.49 U$49.SW1 176.21,90.81 176.21,93.03 188.28,105.09 189.55,105.09 193.36,108.9 194.31,108.9 194.94,109.54 U$82.SW1 195.26,109.86 200.98,115.57 276.54,115.57 v284.48,107.63
  Bottom 0.152: v284.48,107.63 286.7,107.63 289.24,105.09 300.67,105.09 301.94,103.82 U$38.22/A8
COL10
  Top 0.152: U$59.SW1 220.98,14.61 220.98,27.62 218.44,30.16 218.44,33.34 U$34.SW1 218.12,33.66 208.91,42.86 208.91,52.39 U$23.SW1 208.6,52.7 204.79,56.52 204.79,69.85 204.15,70.48 204.15,71.44 U$10.SW1 203.84,71.75 195.58,80.01 195.58,88.58 195.26,88.9 195.26,90.49 U$50.SW1 195.26,90.81 206.69,102.23 206.69,104.46 211.77,109.54 214,109.54 U$83.SW1
  Bottom 0.152: U$38.23/A9 301.94,106.36 295.59,112.71 279.4,112.71 278.13,113.98 218.44,113.98 214.31,109.86 U$83.SW1
COL11  (via drill 0.35)
  Top 0.152: U$84.SW1 233.04,109.54 230.82,109.54 225.74,104.46 225.74,102.23 214.31,90.81 U$51.SW1 214.31,90.49 214.31,88.9 214.63,88.58 214.63,80.01 222.88,71.75 U$11.SW1 222.88,71.44 222.25,70.8 221.3,70.8 219.39,68.9 227.65,60.64 227.65,52.7 U$24.SW1 227.97,52.39 227.97,49.21 v240.03,37.15 | U$38.24 294.64,93.34 294.64,92.39 295.91,91.12 295.91,88.27 294.96,87.31 294.32,87.31 288.29,81.28 288.29,77.47 287.97,77.15 287.97,76.52 277.81,66.36 277.81,64.77 271.14,58.1 271.14,56.2 269.88,54.93 269.88,50.16 253.37,33.66 SW4.1 253.05,33.34 248.28,28.57 248.28,21.59 245.11,18.41 U$67.SW1
  Bottom 0.152: v240.03,37.15 243.52,33.66 253.05,33.66 SW4.1
COL12  (via drill 0.35)
  Top 0.152: U$85.SW1 252.09,109.54 249.87,109.54 244.79,104.46 244.79,102.23 233.36,90.81 U$52.SW1 233.04,90.49 232.41,89.85 231.08,89.85 229.17,87.95 242.19,74.93 U$12.SW1 242.25,71.44 242.25,70.48 242.89,69.85 v242.89,60.33 | U$38.25 294.32,90.81 293.37,90.81 287.34,84.77 286.7,84.77 285.75,83.82 285.75,82.23 273.05,69.53 273.05,67.31 258.44,52.7 SW5.1
  Bottom 0.152: U$60.SW1 269.24,14.61 277.18,22.54 277.18,51.75 264.8,51.75 263.21,53.34 259.08,53.34 258.44,52.7 SW5.1 258.13,52.7 250.51,52.7 v242.89,60.33
COL13  (via drill 0.35)
  Top 0.152: v276.54,83.82 266.06,73.34 266.06,71.75 U$13.SW1 | U$61.SW1 271.14,109.54 270.19,109.54 268.29,107.63 268.29,97.16 261.94,90.81 SW6.1
  Bottom 0.152: 276.54,85.72 275.27,85.72 274.95,86.04 267.97,86.04 266.7,84.77 264.48,84.77 261.94,87.31 261.94,90.49 SW6.1 | 276.54,85.72 282.89,85.72 284.16,87 293.05,87 294.32,88.27 U$38.26 | 276.54,85.72 v276.54,83.82
GND  (via drill 0.35)
  Top 0.152: 293.69,73.03 294.64,72.07 297.18,74.61 D65.C | 293.69,73.03 292.1,74.61 D62.C 292.1,74.93 292.1,75.25 292.74,75.88 292.74,79.06 294.32,80.64 U$38.GND1 | 293.37,95.89 294.32,95.89 U$38.GND2 | 293.37,95.89 287.34,89.85 285.75,89.85 | 285.75,89.85 282.89,89.85 H1.B2,8 | 293.37,95.89 293.37,99.06 297.81,103.5 294.32,107 293.69,107 287.02,113.67 U$38.GND | 285.75,89.85 v285.75,84.77 | H5.B2,8 261.62,40.96 293.69,73.03 | v29.53,103.19 26.67,100.33 26.67,99.06 13.97,86.36 12.06,86.36 5.97,80.26 H8.B2,8 4.06,78.36 1.27,75.56 1.27,54.93 22.86,33.34 22.86,5.08 H6.B2,8
  Bottom 0.152: 289.88,76.52 293.69,72.71 294.32,72.71 297.81,69.22 J1.RING2 | 289.88,76.52 289.88,79.69 290.51,79.69 | 290.51,79.69 293.37,79.69 294.32,80.64 U$38.GND1 | 290.51,79.69 290.51,84.77 v285.75,84.77 | v29.53,103.19 39.37,103.19 J2.EARTH | H8.B2,8 140.97,78.74 H7.B2,8 141.29,78.42 143.19,76.52 289.88,76.52
LED1
  Top 0.152: R1.2 288.93,76.52 288.93,78.74 290.51,80.33 290.51,81.92 294.32,85.72 U$38.27
LED2
  Top 0.152: R2.2 300.36,76.83 297.5,79.69 296.55,79.69 295.59,80.64 295.59,82.23 294.64,83.19 U$38.28
N$1
  Bottom 0.152: D4.A 45.09,73.03 44.13,73.98 39.05,73.98 U$1.SW2
N$2
  Bottom 0.152: D5.A 64.14,73.03 63.18,73.98 58.1,73.98 U$2.SW2
N$3
  Bottom 0.152: D6.A 83.19,73.03 82.23,73.98 77.15,73.98 U$3.SW2
N$4
  Bottom 0.152: D7.A 102.23,73.03 101.28,73.98 96.2,73.98 U$4.SW2
N$5
  Bottom 0.152: D8.A 121.28,73.03 120.33,73.98 115.25,73.98 U$5.SW2
N$6
  Bottom 0.152: D9.A 140.34,73.03 139.38,73.98 134.3,73.98 U$6.SW2
N$7
  Bottom 0.152: D10.A 159.38,73.03 158.43,73.98 153.35,73.98 U$7.SW2
N$8
  Bottom 0.152: D11.A 178.44,73.03 177.48,73.98 172.4,73.98 U$8.SW2
N$9
  Bottom 0.152: D12.A 197.49,73.03 196.53,73.98 191.45,73.98 U$9.SW2
N$10
  Bottom 0.152: D13.A 216.53,73.03 215.58,73.98 210.5,73.98 U$10.SW2
N$11
  Bottom 0.152: D14.A 235.59,73.03 234.63,73.98 229.55,73.98 U$11.SW2
N$12
  Bottom 0.152: D15.A 254.63,73.03 253.68,73.98 248.6,73.98 U$12.SW2
N$13
  Bottom 0.152: D16.A 278.76,73.03 277.81,73.98 272.42,73.98 U$13.SW2
N$14
  Bottom 0.152: D17.A 49.85,53.98 48.9,54.93 43.81,54.93 U$14.SW2
N$15
  Bottom 0.152: D18.A 68.9,53.98 67.94,54.93 62.87,54.93 U$15.SW2
N$16
  Bottom 0.152: D19.A 87.95,53.98 87,54.93 81.92,54.93 U$16.SW2
N$17
  Bottom 0.152: D20.A 107,53.98 106.05,54.93 100.97,54.93 U$17.SW2
N$18
  Bottom 0.152: D21.A 126.05,53.98 125.09,54.93 120.02,54.93 U$18.SW2
N$19
  Bottom 0.152: D22.A 145.1,53.98 144.15,54.93 139.06,54.93 U$19.SW2
N$20
  Bottom 0.152: D23.A 164.15,53.98 163.19,54.93 158.12,54.93 U$20.SW2
N$21
  Bottom 0.152: D24.A 183.2,53.98 182.25,54.93 177.16,54.93 U$21.SW2
N$22
  Bottom 0.152: D25.A 202.25,53.98 201.29,54.93 196.22,54.93 U$22.SW2
N$23
  Bottom 0.152: D26.A 221.3,53.98 220.34,54.93 215.26,54.93 U$23.SW2
N$24
  Bottom 0.152: D27.A 240.35,53.98 239.4,54.93 234.31,54.93 U$24.SW2
N$25
  Bottom 0.152: D28.A 59.37,34.92 58.42,35.88 53.34,35.88 U$25.SW2
N$26
  Bottom 0.152: D29.A 78.42,34.92 77.47,35.88 72.39,35.88 U$26.SW2
N$27
  Bottom 0.152: D30.A 97.47,34.92 96.52,35.88 91.44,35.88 U$27.SW2
N$28
  Bottom 0.152: D31.A 116.52,34.92 115.57,35.88 110.49,35.88 U$28.SW2
N$29
  Bottom 0.152: D32.A 135.57,34.92 134.62,35.88 129.54,35.88 U$29.SW2
N$30
  Bottom 0.152: D33.A 154.62,34.92 153.67,35.88 148.59,35.88 U$30.SW2
N$31
  Bottom 0.152: D34.A 173.67,34.92 172.72,35.88 167.64,35.88 U$31.SW2
N$32
  Bottom 0.152: D35.A 192.72,34.92 191.77,35.88 186.69,35.88 U$32.SW2
N$33
  Bottom 0.152: D36.A 211.77,34.92 210.82,35.88 205.74,35.88 U$33.SW2
N$34
  Bottom 0.152: D37.A 230.82,34.92 229.87,35.88 224.79,35.88 U$34.SW2
N$35
  Bottom 0.152: D60.A 281.62,15.88 280.35,17.14 275.59,17.14 U$60.SW2
N$36
  Bottom 0.152: D61.A 283.85,111.12 282.89,112.08 277.81,112.08 U$61.SW2
N$37
  Top 0.152: D62.A 291.78,76.52 290.83,76.52 R1.1
N$38
  Top 0.152: D65.A 297.5,76.52 298.45,76.52 R2.1
N$41
  Bottom 0.152: U$67.SW2 256.54,17.14 257.81,15.88 D67.A
N$43
  Bottom 0.152: D57.A 138.43,16.19 137.79,16.83 132.4,16.83 SW2.2
N$44
  Bottom 0.152: D87.A 26.67,111.12 25.72,112.08 20.64,112.08 SW1.2
N$51
  Bottom 0.152: D1.A 21.27,73.03 20.32,73.98 15.24,73.98 U$36.SW2
N$52
  Bottom 0.152: D2.A 23.5,53.66 22.23,54.93 17.46,54.93 U$37.SW2
N$53
  Bottom 0.152: D3.A 28.26,34.61 26.99,35.88 22.23,35.88 SW3.2
N$54
  Bottom 0.152: D38.A 265.75,35.24 265.11,35.88 259.71,35.88 SW4.2
N$55
  Bottom 0.152: D39.A 270.51,53.66 269.24,54.93 264.8,54.93 SW5.2
N$56
  Bottom 0.152: D40.A 36.2,92.08 35.24,93.03 30.16,93.03 U$41.SW2
N$57
  Bottom 0.152: D41.A 55.24,92.08 54.29,93.03 49.21,93.03 U$42.SW2
N$58
  Bottom 0.152: D42.A 74.3,92.08 73.34,93.03 68.26,93.03 U$43.SW2
N$59
  Bottom 0.152: D43.A 93.34,92.08 92.39,93.03 87.31,93.03 U$44.SW2
N$60
  Bottom 0.152: D44.A 112.39,92.08 111.44,93.03 106.36,93.03 U$45.SW2
N$61
  Bottom 0.152: D45.A 131.44,92.08 130.49,93.03 125.41,93.03 U$46.SW2
N$62
  Bottom 0.152: D46.A 150.5,92.08 149.54,93.03 144.46,93.03 U$47.SW2
N$63
  Bottom 0.152: D47.A 169.54,92.08 168.59,93.03 163.51,93.03 U$48.SW2
N$64
  Bottom 0.152: D48.A 188.59,92.08 187.64,93.03 182.56,93.03 U$49.SW2
N$65
  Bottom 0.152: D49.A 207.65,92.08 206.69,93.03 201.61,93.03 U$50.SW2
N$66
  Bottom 0.152: D50.A 226.69,92.08 225.74,93.03 220.66,93.03 U$51.SW2
N$67
  Bottom 0.152: D51.A 245.75,92.08 244.79,93.03 239.71,93.03 U$52.SW2
N$68
  Bottom 0.152: D52.A 274.32,92.08 273.37,93.03 268.29,93.03 SW6.2
N$70
  Bottom 0.152: D54.A 19.37,15.88 18.41,16.83 13.02,16.83 U$35.SW2
N$71
  Bottom 0.152: D55.A 43.18,15.88 42.23,16.83 36.83,16.83 U$55.SW2
N$72
  Bottom 0.152: D56.A 66.99,15.88 66.04,16.83 60.96,16.83 U$56.SW2
N$74
  Bottom 0.152: D58.A 209.87,15.88 208.6,17.14 203.84,17.14 U$58.SW2
N$75
  Bottom 0.152: D59.A 233.68,16.19 232.73,17.14 227.65,17.14 U$59.SW2
N$83
  Bottom 0.152: D53.A 17.14,92.08 16.19,93.03 11.11,93.03 U$54.SW2
N$119
  Bottom 0.152: D74.A 55.24,111.12 54.29,112.08 49.21,112.08 U$74.SW2
N$120
  Bottom 0.152: D75.A 74.3,111.12 73.34,112.08 68.26,112.08 U$75.SW2
N$121
  Bottom 0.152: D76.A 93.34,111.12 92.39,112.08 87.31,112.08 U$76.SW2
N$122
  Bottom 0.152: D77.A 112.39,111.12 111.44,112.08 106.36,112.08 U$77.SW2
N$123
  Bottom 0.152: D78.A 131.44,111.12 130.49,112.08 125.41,112.08 U$78.SW2
N$124
  Bottom 0.152: D79.A 150.5,111.12 149.54,112.08 144.46,112.08 U$79.SW2
N$125
  Bottom 0.152: D80.A 169.54,111.12 168.59,112.08 163.51,112.08 U$80.SW2
N$126
  Bottom 0.152: D81.A 188.59,111.12 187.64,112.08 182.56,112.08 U$81.SW2
N$127
  Bottom 0.152: D82.A 207.65,111.12 206.69,112.08 201.61,112.08 U$82.SW2
N$128
  Bottom 0.152: D83.A 226.69,111.12 225.74,112.08 220.66,112.08 U$83.SW2
N$129
  Bottom 0.152: D84.A 245.75,111.12 244.79,112.08 239.71,112.08 U$84.SW2
N$130
  Bottom 0.152: D85.A 264.8,111.12 263.84,112.08 258.76,112.08 U$85.SW2
ROW0
  Top 0.152: U$38.2 286.7,106.05 284.16,103.5 D61.C | D77.C 112.39,103.5 93.66,103.5 D76.C | D85.C 264.8,103.5 246.06,103.5 D84.C
  Bottom 0.152: D85.C 265.11,103.5 283.85,103.5 D61.C | D84.C 245.75,103.5 227.01,103.5 D83.C 226.69,103.5 207.96,103.5 D82.C 207.65,103.5 188.91,103.5 D81.C 188.59,103.5 169.86,103.5 D80.C 169.54,103.5 150.81,103.5 D79.C 150.5,103.5 131.76,103.5 D78.C 131.44,103.5 112.71,103.5 D77.C | D76.C 93.34,103.5 74.61,103.5 D75.C 74.3,103.5 55.56,103.5 D74.C 55.24,103.19 54.29,102.23 27.94,102.23 26.99,103.19 D87.C
ROW1
  Top 0.152: U$38.3 286.7,103.5 286.07,103.5 284.16,101.6 278.45,101.6 268.61,91.76 264.8,91.76 262.25,89.22 250.82,89.22 246.06,84.45 D51.C
  Bottom 0.152: D52.C 274.32,84.45 246.06,84.45 D51.C 245.75,84.45 227.01,84.45 D50.C 226.69,84.45 207.96,84.45 D49.C 207.65,84.45 188.91,84.45 D48.C 188.59,84.45 169.86,84.45 D47.C 169.54,84.45 150.81,84.45 D46.C 150.5,84.45 131.76,84.45 D45.C 131.44,84.45 112.71,84.45 D44.C 112.39,84.45 93.66,84.45 D43.C 93.34,84.45 74.61,84.45 D42.C 74.3,84.45 55.56,84.45 D41.C 55.24,84.45 36.51,84.45 D40.C 36.2,84.45 17.46,84.45 D53.C
ROW2  (via drill 0.35)
  Top 0.152: v262.57,75.88 286.7,100.01 286.7,100.97 U$38.4
  Bottom 0.152: 262.57,65.41 254.95,65.41 D15.C 254.63,65.41 235.9,65.41 D14.C 235.59,65.41 216.85,65.41 D13.C 216.53,65.41 197.8,65.41 D12.C 197.49,65.41 178.75,65.41 D11.C 178.44,65.41 159.7,65.41 D10.C 159.38,65.41 140.65,65.41 D9.C 140.34,65.41 121.6,65.41 D8.C 121.28,65.41 102.55,65.41 D7.C 102.23,65.41 83.5,65.41 D6.C 83.19,65.41 64.45,65.41 D5.C 64.14,65.41 45.4,65.41 D4.C 45.09,65.41 21.59,65.41 D1.C | 262.57,65.41 278.76,65.41 D16.C | 262.57,65.41 v262.57,75.88
ROW3
  Top 0.152: U$38.5 286.7,98.42 286.07,98.42 254,66.36 254,64.77 247.33,58.1 247.33,53.02 240.66,46.35 D27.C
  Bottom 0.152: D39.C 270.51,46.04 240.66,46.04 D27.C 240.35,46.35 221.62,46.35 D26.C 221.3,46.35 202.56,46.35 D25.C 202.25,46.35 183.51,46.35 D24.C 183.2,46.35 164.47,46.35 D23.C 164.15,46.35 145.41,46.35 D22.C 145.1,46.35 126.36,46.35 D21.C 126.05,46.35 107.31,46.35 D20.C 107,46.35 88.27,46.35 D19.C 87.95,46.35 69.22,46.35 D18.C 68.9,46.35 50.16,46.35 D17.C 49.85,46.04 23.81,46.04 D2.C
ROW4
  Top 0.152: D33.C 154.94,27.3 173.67,27.3 D34.C 173.99,27.3 192.72,27.3 D35.C | D32.C 135.57,27.3 116.84,27.3 D31.C 116.52,27.3 97.79,27.3 D30.C 97.47,27.3 78.74,27.3 D29.C | U$38.6 286.7,95.89 284.16,95.89 273.69,85.41 273.69,81.6 264.16,72.07 264.16,70.8 262.89,69.53 262.89,59.69 242.25,39.05 242.25,38.42 231.14,27.3 D37.C
  Bottom 0.152: D3.C 28.57,26.99 59.37,26.99 D28.C 59.69,27.3 78.42,27.3 D29.C | D33.C 154.62,27.3 135.89,27.3 D32.C | D35.C 193.04,27.3 211.77,27.3 D36.C 212.09,27.3 230.82,27.3 D37.C 231.14,27.3 265.75,27.3 D38.C
ROW5
  Top 0.152: D55.C 43.18,8.26 66.99,8.26 D56.C 67.31,8.26 138.43,8.26 D57.C 138.75,8.26 209.87,8.26 D58.C 210.19,8.26 233.68,8.26 D59.C | U$38.11 286.7,83.19 286.7,82.23 285.75,81.28 285.75,74.93 277.5,66.67 277.5,65.09 270.83,58.42 270.83,56.52 269.56,55.24 269.56,52.07 241.94,24.45 241.94,23.5 241.62,23.18 241.62,16.19 234,8.57 D59.C | D67.C 257.81,8.26 234,8.26 D59.C
  Bottom 0.152: D54.C 19.68,8.26 43.18,8.26 D55.C | D67.C 258.13,8.26 281.62,8.26 D60.C
RX2
  Bottom 0.152: J1.EARTH 291.46,77.15 292.1,76.52 295.27,76.52 296.55,75.25 299.4,75.25 299.4,79.69 299.08,79.69 298.45,80.33 298.45,89.53 287.97,89.53 287.02,88.58 U$38.9
RX3
  Bottom 0.152: J2.RING2 33.02,111.44 33.02,109.54 31.75,109.54 31.43,109.22 31.43,107.63 35.56,107.63 35.88,107.95 38.42,107.95 42.55,103.82 53.66,103.82 54.93,105.09 63.18,105.09 64.45,103.82 72.71,103.82 73.98,105.09 82.23,105.09 83.5,103.82 91.76,103.82 93.03,105.09 97.79,105.09 105.09,97.79 282.57,97.79 286.7,93.66 U$38.7
TX2
  Bottom 0.152: J1.TIP 298.13,76.2 298.13,84.77 291.15,84.77 290.19,85.72 287.02,85.72 U$38.10
TX3  (via drill 0.35)
  Top 0.152: v281.31,98.74 282.89,98.74 286.38,102.23 287.02,102.23 292.42,96.84 286.7,91.12 U$38.8
  Bottom 0.152: v281.31,98.74 104.78,98.74 94.61,108.9 88.27,108.9 83.19,113.98 44.77,113.98 41.91,111.12 35.88,111.12 33.34,108.58 J2.RING1
VUSB  (via drill 0.35)
  Top 0.152: v299.08,73.34 299.08,73.66 301.31,75.88 301.31,80.01 300.67,80.64 300.67,98.74 301.62,99.69 302.26,99.69 303.21,100.65 303.21,111.44 301.94,112.71 300.99,112.71 299.72,111.44 U$38.VUSB
  Bottom 0.152: v299.08,73.34 298.13,72.39 J1.RING1 | J2.TIP 33.02,104.78 30.48,107.31 30.48,111.44 30.8,111.44 34.29,114.94 295.91,114.94 299.4,111.44 U$38.VUSB

### Text on the board
tPlace: TeXbrd mk1 -- lysandrou2018
tNames: ESC | F1 | F2 | F3 | F4 | F5 | F6 | F7 | F8 | F9 | F10 | F11 | F12 | xtra | ~ | 1 | 2 | 3 | 4 | 5 | 6 | 7 | 8 | 9 | 0 | - | + | BS | tab | q | w | e | r | t | y | u | i | o | p | [ | ] | slash | caps | a | s | d | f | g | h | j | k | l | ; | ' | enter | shift | z | x | c | v | b | n | m | < | > | ? | shift | CTROL | OS/SUPER | ALT/META | SPACE | GREEK | FN/HYPER | MATH | CNTROL